# EAGLE schematic schema esp01-doma (EAGLE 7.3.0)
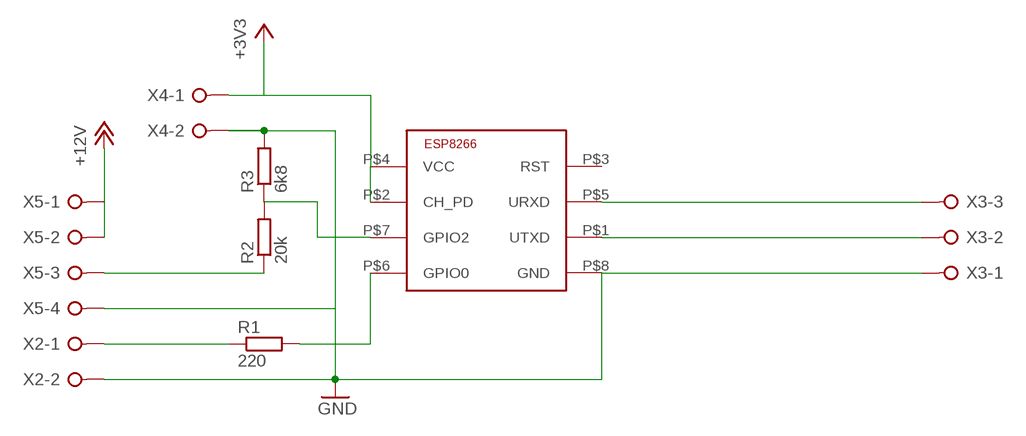
[diagram p0: schematic, sheet 1]

## Parts
R1  220  R-EU_0204/7  [0204/7]
R2  20k  R-EU_0204/7  [0204/7]
R3  6k8  R-EU_0204/7  [0204/7]
U$1  ESP8266-01  [ESP-01]
X2  W237-02P  [W237-132]
X3  W237-3E  [W237-3E]
X4  W237-02P  [W237-132]
X5  W237-04P  [W237-4P]

## Nets
+3V3: U$1.P$2(CH_PD) U$1.P$4(VCC) X4.1
+12V: X5.1 X5.2
GND: R3.2 U$1.P$8(GND) X2.2 X3.1 X4.2 X5.4
N$1: R2.1 X5.3
N$2: R1.1 X2.1
N$3: R1.2 U$1.P$6(GPIO0)
N$5: U$1.P$5(URXD) X3.3
N$6: U$1.P$1(UTXD) X3.2
N$7: R2.2 R3.1 U$1.P$7(GPIO2)
Unconnected: U$1.P$3(RST)

## Library data of the parts
R1-R3 = rcl:R-EU_: RESISTOR, European symbol
U$1 = ESP8266:ESP8266-01: ESP8266 - ESP-01 Module
X2 X4 = con-wago-508:W237-02P: WAGO SREW CLAMP; OC_FARNELL: unknown; OC_NEWARK: unknown
X3 = con-wago-508:W237-3E: WAGO SREW CLAMP; OC_FARNELL: unknown; OC_NEWARK: unknown
X5 = con-wago-508:W237-04P: WAGO SREW CLAMP; OC_FARNELL: unknown; OC_NEWARK: unknown